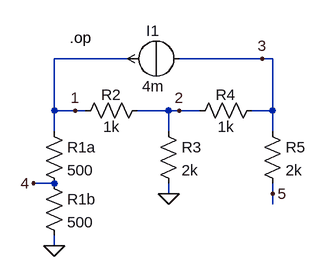
[diagram p0: schematic ersatz_2.asc]
ersatz_2.asc, the LTspice schematic file:
Version 4
SHEET 1 880 680
WIRE 192 32 80 32
WIRE 400 32 272 32
WIRE 416 32 400 32
WIRE 80 112 80 32
WIRE 112 112 80 112
WIRE 128 112 112 112
WIRE 256 112 208 112
WIRE 272 112 256 112
WIRE 304 112 272 112
WIRE 416 112 416 32
WIRE 416 112 384 112
WIRE 80 144 80 112
WIRE 256 144 256 112
WIRE 416 144 416 112
WIRE 80 224 48 224
WIRE 256 240 256 224
WIRE 416 240 416 224
WIRE 416 256 416 240
WIRE 80 320 80 304
FLAG 80 320 0
FLAG 256 240 0
FLAG 112 112 1
FLAG 272 112 2
FLAG 400 32 3
FLAG 48 224 4
FLAG 416 240 5
SYMBOL res 64 128 R0
SYMATTR InstName R1a
SYMATTR Value 500
SYMBOL res 112 128 R270
WINDOW 0 25 56 VTop 2
WINDOW 3 7 56 VBottom 2
SYMATTR InstName R2
SYMATTR Value 1k
SYMBOL res 240 128 R0
SYMATTR InstName R3
SYMATTR Value 2k
SYMBOL res 288 128 R270
WINDOW 0 25 56 VTop 2
WINDOW 3 7 56 VBottom 2
SYMATTR InstName R4
SYMATTR Value 1k
SYMBOL source-I 192 32 R270
WINDOW 0 27 40 VTop 2
WINDOW 3 -27 40 VBottom 2
SYMATTR InstName I1
SYMATTR Value 4m
SYMBOL res 64 208 R0
SYMATTR InstName R1b
SYMATTR Value 500
SYMBOL res 400 128 R0
SYMATTR InstName R5
SYMATTR Value 2k
TEXT 104 0 Left 2 !.op

The netlist it stands for:
* ersatz_2.asc
R1a 1 4 500
R2 1 2 1k
R3 2 0 2k
R4 2 3 1k
I1 3 1 4m
R1b 4 0 500
R5 3 5 2k
.op
.backanno
.end